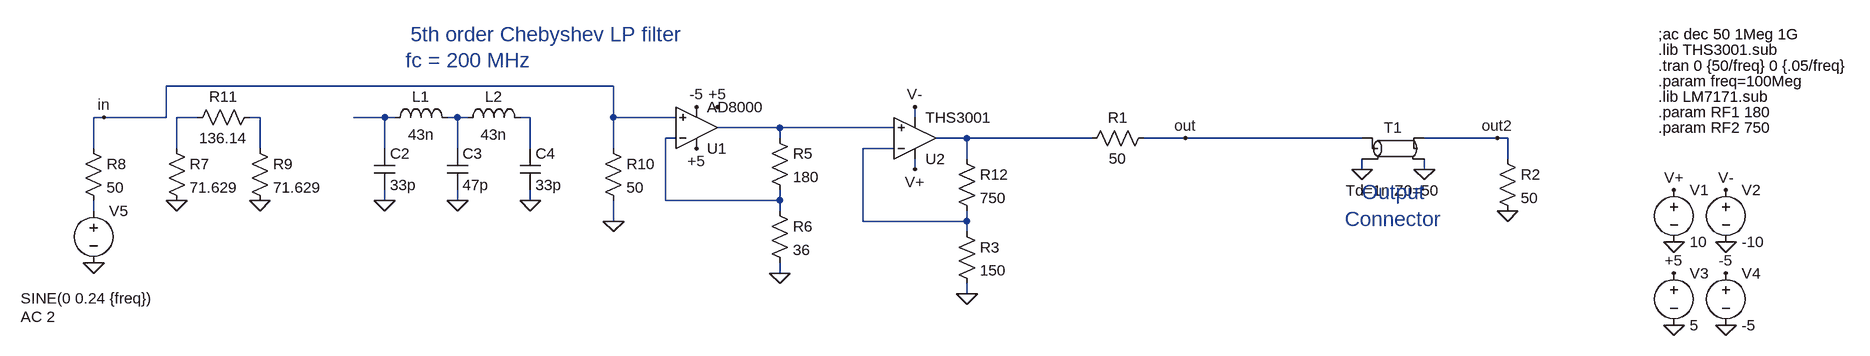
[diagram p0: schematic outputamp.asc]
outputamp.asc, the LTspice schematic file:
Version 4
SHEET 1 2148 712
WIRE 192 32 -496 32
WIRE -592 80 -608 80
WIRE -496 80 -496 32
WIRE -496 80 -592 80
WIRE -448 80 -480 80
WIRE -352 80 -368 80
WIRE -160 80 -208 80
WIRE -144 80 -160 80
WIRE -48 80 -64 80
WIRE -32 80 -48 80
WIRE 64 80 48 80
WIRE 192 80 192 32
WIRE 288 80 192 80
WIRE 656 80 656 64
WIRE 448 96 352 96
WIRE 624 96 448 96
WIRE 288 112 272 112
WIRE 448 112 448 96
WIRE 736 112 688 112
WIRE 928 112 736 112
WIRE 1072 112 1008 112
WIRE 1344 112 1072 112
WIRE 1552 112 1440 112
WIRE 1568 112 1552 112
WIRE -608 128 -608 80
WIRE -480 128 -480 80
WIRE -352 128 -352 80
WIRE -160 128 -160 80
WIRE -48 128 -48 80
WIRE 64 128 64 80
WIRE 192 128 192 80
WIRE 624 128 576 128
WIRE 736 144 736 112
WIRE 1568 144 1568 112
WIRE 656 160 656 144
WIRE 1344 160 1344 144
WIRE 1440 160 1440 144
WIRE -160 208 -160 192
WIRE -48 208 -48 192
WIRE 64 208 64 192
WIRE 272 208 272 112
WIRE 448 208 448 192
WIRE 448 208 272 208
WIRE -608 224 -608 208
WIRE 448 224 448 208
WIRE 192 240 192 208
WIRE 576 240 576 128
WIRE 736 240 736 224
WIRE 736 240 576 240
WIRE 736 256 736 240
WIRE 448 320 448 304
WIRE 736 352 736 336
FLAG 1824 272 0
FLAG 1904 272 0
FLAG 1824 192 V+
FLAG 1904 192 V-
FLAG -608 304 0
FLAG 656 160 V+
FLAG 656 64 V-
FLAG -160 208 0
FLAG -48 208 0
FLAG 64 208 0
FLAG 1568 224 0
FLAG 1344 160 0
FLAG 1440 160 0
FLAG -592 80 in
FLAG 1552 112 out2
FLAG 320 128 +5
FLAG 320 64 -5
FLAG 448 320 0
FLAG 1824 400 0
FLAG 1904 400 0
FLAG 1824 320 +5
FLAG 1904 320 -5
FLAG 352 64 +5
FLAG 192 240 0
FLAG -352 208 0
FLAG -480 208 0
FLAG 736 352 0
FLAG 1072 112 out
SYMBOL voltage 1824 176 R0
WINDOW 123 0 0 Left 2
WINDOW 39 0 0 Left 2
SYMATTR InstName V1
SYMATTR Value 10
SYMBOL voltage 1904 176 R0
WINDOW 123 0 0 Left 2
WINDOW 39 0 0 Left 2
SYMATTR InstName V2
SYMATTR Value -10
SYMBOL voltage -608 208 R0
WINDOW 3 -112 151 Left 2
WINDOW 123 -112 179 Left 2
WINDOW 39 0 0 Left 2
SYMATTR Value SINE(0 0.24 {freq})
SYMATTR Value2 AC 2
SYMATTR InstName V5
SYMBOL Opamps\\opamp2 656 176 M180
SYMATTR InstName U2
SYMATTR Value THS3001
SYMBOL res 1024 96 R90
WINDOW 0 0 56 VBottom 2
WINDOW 3 32 56 VTop 2
SYMATTR InstName R1
SYMATTR Value 50
SYMBOL cap -176 128 R0
SYMATTR InstName C2
SYMATTR Value 33p
SYMBOL ind -160 96 R270
WINDOW 0 32 56 VTop 2
WINDOW 3 5 56 VBottom 2
SYMATTR InstName L1
SYMATTR Value 43n
SYMBOL cap -64 128 R0
SYMATTR InstName C3
SYMATTR Value 47p
SYMBOL ind -48 96 R270
WINDOW 0 32 56 VTop 2
WINDOW 3 5 56 VBottom 2
SYMATTR InstName L2
SYMATTR Value 43n
SYMBOL cap 48 128 R0
SYMATTR InstName C4
SYMATTR Value 33p
SYMBOL tline 1392 128 R0
WINDOW 3 0 49 Top 2
SYMATTR Value Td=1n Z0=50
SYMATTR InstName T1
SYMBOL res 1552 128 R0
SYMATTR InstName R2
SYMATTR Value 50
SYMBOL res 432 96 R0
SYMATTR InstName R5
SYMATTR Value 180
SYMBOL res 432 208 R0
SYMATTR InstName R6
SYMATTR Value 36
SYMBOL voltage 1824 304 R0
WINDOW 123 0 0 Left 2
WINDOW 39 0 0 Left 2
SYMATTR InstName V3
SYMATTR Value 5
SYMBOL voltage 1904 304 R0
WINDOW 123 0 0 Left 2
WINDOW 39 0 0 Left 2
SYMATTR InstName V4
SYMATTR Value -5
SYMBOL Opamps\\AD\\AD8000 320 160 M180
SYMATTR InstName U1
SYMBOL res -624 112 R0
SYMATTR InstName R8
SYMATTR Value 50
SYMBOL res -496 112 R0
SYMATTR InstName R7
SYMATTR Value 71.629
SYMBOL res -368 112 R0
SYMATTR InstName R9
SYMATTR Value 71.629
SYMBOL res 176 112 R0
SYMATTR InstName R10
SYMATTR Value 50
SYMBOL res -352 64 R90
WINDOW 0 0 56 VBottom 2
WINDOW 3 32 56 VTop 2
SYMATTR InstName R11
SYMATTR Value 136.14
SYMBOL res 720 128 R0
SYMATTR InstName R12
SYMATTR Value 750
SYMBOL res 720 240 R0
SYMATTR InstName R3
SYMATTR Value 150
TEXT 1800 24 Left 2 !.param freq=100Meg
TEXT 1800 0 Left 2 !.tran 0 {50/freq} 0 {.05/freq}
TEXT 1800 -48 Left 2 !;ac dec 50 1Meg 1G
TEXT 1800 -24 Left 2 !.lib THS3001.sub
TEXT -120 -48 Left 3 ;5th order Chebyshev LP filter
TEXT -128 -8 Left 3 ;fc = 200 MHz
TEXT 1392 216 Center 3 ;Output\nConnector
TEXT 1800 48 Left 2 !.lib LM7171.sub
TEXT 1800 72 Left 2 !.param RF1 180
TEXT 1800 96 Left 2 !.param RF2 750

The netlist it stands for:
* outputamp.asc
V1 V+ 0 10
V2 V- 0 -10
V5 N010 0 SINE(0 0.24 {freq}) AC 2
XU2 N006 N009 V+ V- N008 THS3001  ; pins In+ In- V+ V- OUT
R1 out N008 50
C2 N003 0 33p
L1 N003 N004 43n
C3 N004 0 47p
L2 N004 N005 43n
C4 N005 0 33p
T1 out 0 out2 0 Td=1n Z0=50
R2 out2 0 50
R5 N006 N007 180
R6 N007 0 36
V3 +5 0 5
V4 -5 0 -5
XU1 in N007 +5 -5 N006 AD8000  ; pins In+ In- V+ V- OUT
R8 in N010 50
R7 N001 0 71.629
R9 N002 0 71.629
R10 in 0 50
R11 N002 N001 136.14
R12 N008 N009 750
R3 N009 0 150
.param freq=100Meg
.tran 0 {50/freq} 0 {.05/freq}
;ac dec 50 1Meg 1G
.lib THS3001.sub
* 5th order Chebyshev LP filter
* fc = 200 MHz
* Output
* Connector
.lib LM7171.sub
.param RF1 180
.param RF2 750
.backanno
.end